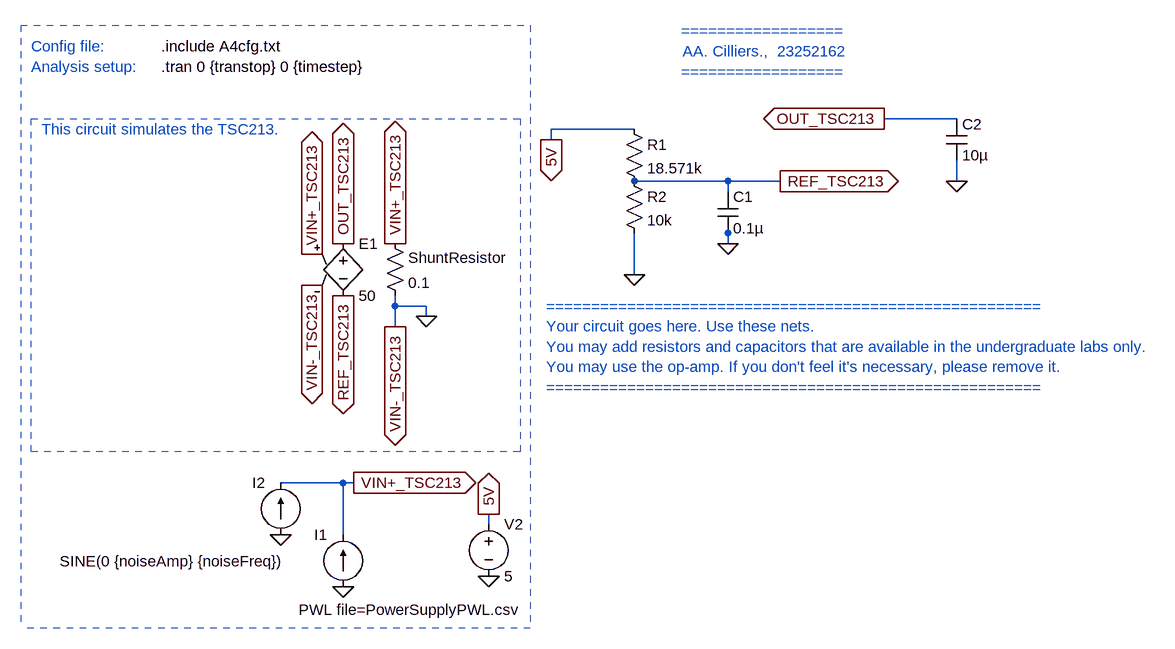
[diagram p0: schematic E344_23252162_A4.asc]
E344_23252162_A4.asc, the LTspice schematic file:
Version 4
SHEET 1 1824 680
WIRE -928 -1280 -1040 -1280
WIRE -1424 -1264 -1552 -1264
WIRE -1552 -1248 -1552 -1264
WIRE -1280 -1184 -1424 -1184
WIRE -1200 -1184 -1280 -1184
WIRE -928 -1184 -928 -1216
WIRE -1280 -1168 -1280 -1184
WIRE -1280 -1104 -1280 -1120
WIRE -1280 -1088 -1280 -1104
WIRE -1424 -1040 -1424 -1104
WIRE -1792 -992 -1792 -1008
WIRE -1744 -992 -1792 -992
WIRE -1744 -976 -1744 -992
WIRE -1792 -960 -1792 -992
WIRE -1872 -720 -1968 -720
WIRE -1856 -720 -1872 -720
WIRE -1648 -656 -1648 -672
WIRE -1872 -640 -1872 -720
FLAG -1648 -672 5V
IOPIN -1648 -672 Out
FLAG -1648 -576 0
FLAG -1040 -1280 OUT_TSC213
IOPIN -1040 -1280 Out
FLAG -1872 -560 0
FLAG -1792 -1088 VIN+_TSC213
IOPIN -1792 -1088 Out
FLAG -1792 -960 VIN-_TSC213
IOPIN -1792 -960 Out
FLAG -1920 -1024 VIN-_TSC213
IOPIN -1920 -1024 Out
FLAG -1920 -1072 VIN+_TSC213
IOPIN -1920 -1072 Out
FLAG -1872 -1008 REF_TSC213
IOPIN -1872 -1008 Out
FLAG -1872 -1088 OUT_TSC213
IOPIN -1872 -1088 Out
FLAG -1856 -720 VIN+_TSC213
IOPIN -1856 -720 Out
FLAG -1968 -640 0
FLAG -1552 -1248 5V
IOPIN -1552 -1248 Out
FLAG -1744 -976 0
FLAG -1200 -1184 REF_TSC213
IOPIN -1200 -1184 Out
FLAG -1280 -1088 0
FLAG -928 -1184 0
FLAG -1424 -1040 0
SYMBOL e -1872 -1104 R0
SYMATTR InstName E1
SYMATTR Value 50
SYMBOL current -1872 -560 R180
WINDOW 0 24 80 Left 2
WINDOW 3 -271 -35 Left 2
WINDOW 123 0 0 Left 0
WINDOW 39 0 0 Left 0
SYMATTR InstName I1
SYMATTR Value PWL file=PowerSupplyPWL.csv
SYMBOL res -1808 -1104 R0
WINDOW 0 36 38 Left 2
SYMATTR InstName ShuntResistor
SYMATTR Value 0.1
SYMBOL voltage -1648 -672 R0
WINDOW 123 0 0 Left 0
WINDOW 39 0 0 Left 0
SYMATTR InstName V2
SYMATTR Value 5
SYMBOL current -1968 -640 R180
WINDOW 0 24 80 Left 2
WINDOW 3 -7 -41 Left 2
WINDOW 123 0 0 Left 0
WINDOW 39 0 0 Left 0
SYMATTR InstName I2
SYMATTR Value SINE(0 {noiseAmp} {noiseFreq})
SYMBOL res -1440 -1280 R0
SYMATTR InstName R1
SYMATTR Value 18.571k
SYMBOL res -1440 -1200 R0
SYMATTR InstName R2
SYMATTR Value 10k
SYMBOL cap -1296 -1168 R0
SYMATTR InstName C1
SYMATTR Value 0.1µ
SYMBOL cap -944 -1280 R0
SYMATTR InstName C2
SYMATTR Value 10µ
TEXT -2152 -1360 Left 2 !.tran 0 {transtop} 0 {timestep}
TEXT -2152 -1392 Left 2 !.include A4cfg.txt
TEXT -2352 -1392 Left 2 ;Config file:
TEXT -2352 -1360 Left 2 ;Analysis setup:
TEXT -1224 -1384 Center 2 ;==================\nAA. Cilliers.,  23252162\n==================
TEXT -1560 -992 Left 2 ;=======================================================\nYour circuit goes here. Use these nets.\nYou may add resistors and capacitors that are available in the undergraduate labs only.\nYou may use the op-amp. If you don't feel it's necessary, please remove it.\n=======================================================
TEXT -2336 -1264 Left 2 ;This circuit simulates the TSC213.
LINE Normal -1584 -1424 -1584 -496 2
LINE Normal -2368 -1424 -1584 -1424 2
LINE Normal -1584 -496 -2368 -496 2
LINE Normal -1584 -512 -1584 -512 2
LINE Normal -2368 -1424 -2368 -496 2
RECTANGLE Normal -2352 -1280 -1600 -768 2

The netlist it stands for:
* E344_23252162_A4.asc
E1 OUT_TSC213 REF_TSC213 VIN+_TSC213 0 50
I1 0 VIN+_TSC213 PWL file=PowerSupplyPWL.csv
R§ShuntResistor VIN+_TSC213 0 0.1
V2 5V 0 5
I2 0 VIN+_TSC213 SINE(0 {noiseAmp} {noiseFreq})
R1 5V REF_TSC213 18.571k
R2 REF_TSC213 0 10k
C1 REF_TSC213 0 0.1µ
C2 OUT_TSC213 0 10µ
.tran 0 {transtop} 0 {timestep}
.include A4cfg.txt
* Config file:
* Analysis setup:
* ==================
* AA. Cilliers.,  23252162
* ==================
* =======================================================
* Your circuit goes here. Use these nets.
* You may add resistors and capacitors that are available in the undergraduate labs only.
* You may use the op-amp. If you don't feel it's necessary, please remove it.
* =======================================================
* This circuit simulates the TSC213.
.backanno
.end

* Results of the author's LTspice run, read from the files saved beside the schematic
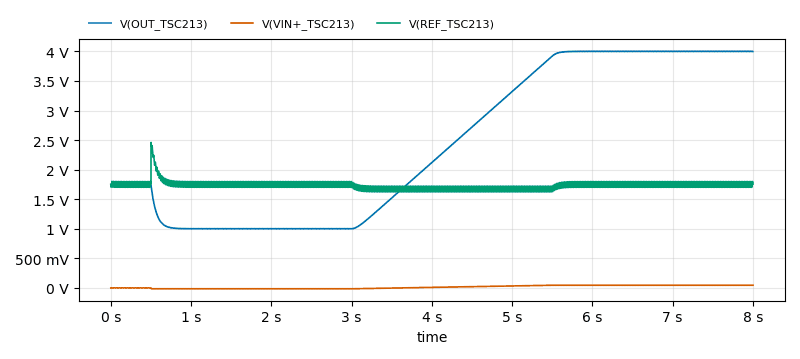
[diagram p1: Transient Analysis of E344_23252162_A4.asc, plotted from the saved traces]
* Transient Analysis, 1 run:
*   V(OUT_TSC213): min 997.6 mV, max 4.002 V, average 2.435 V, rms 2.754 V, last 3.998 V
*   V(VIN+_TSC213): min -16 mV, max 46 mV, average 14.06 mV, rms 29.46 mV, last 45 mV
*   V(REF_TSC213): min 1.623 V, max 2.469 V, average 1.732 V, rms 1.733 V, last 1.748 V